# Altium schematic sheet Main.SchDoc
size A
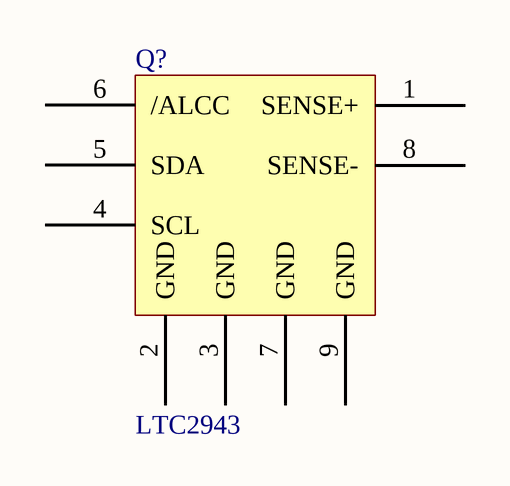
[diagram p0: Main.SchDoc]

## Parts
Q?  LTC2943  [DD Package]

## Nets

Not connected (* = marked no-connect by the designer): Q? 1(SENSE+) 2(GND) 3(GND) 4(SCL) 5(SDA) 6(/ALCC) 7(GND) 8(SENSE-) 9(GND)

## Library data of the parts
Q? = LTC2943: Multicell Battery Gas Gauge  with Temperature, Voltage   and Current Measurement